# EAGLE schematic Esquematico (EAGLE 9.6.2)
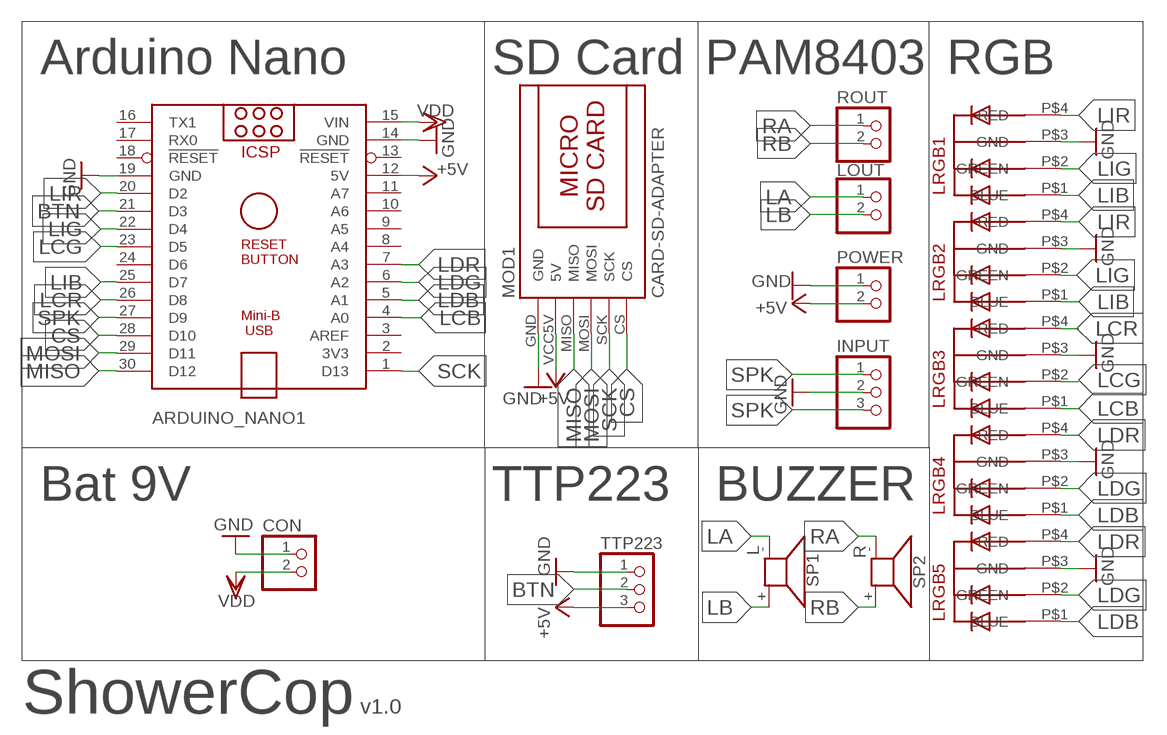
[diagram p0: schematic, sheet 1]

## Parts
ARDUINO_NANO1  ARDUINO_NANO  [ARDUINO_NANO]
CON  PINHD-1X2  [1X02]
INPUT  PINHD-1X3  [1X03]
LOUT  PINHD-1X2  [1X02]
LRGB1  5MMRGBLED  [LED5MMRGB]
LRGB2  5MMRGBLED  [LED5MMRGB]
LRGB3  5MMRGBLED  [LED5MMRGB]
LRGB4  5MMRGBLED  [LED5MMRGB]
LRGB5  5MMRGBLED  [LED5MMRGB]
MOD1  CARD-SD-ADAPTER  CARD-SD-ADAPTER-CATALEX  [CARD-SD-ADAPTER-CATALEX]
POWER  PINHD-1X2  [1X02]
ROUT  PINHD-1X2  [1X02]
SP1  L  AL11P  [AL11P]
SP2  R  AL11P  [AL11P]
TTP223  PINHD-1X3  [1X03]

## Nets
+5V: ARDUINO_NANO1.12(5V) MOD1.VCC5V(5V) POWER.2 TTP223.3
BTN: ARDUINO_NANO1.21(D3) TTP223.2
CS: ARDUINO_NANO1.28(D10) MOD1.CS
GND: ARDUINO_NANO1.14(GND) ARDUINO_NANO1.19(GND) CON.1 INPUT.2 LRGB1.P$3(GND) LRGB2.P$3(GND) LRGB3.P$3(GND) LRGB4.P$3(GND) LRGB5.P$3(GND) MOD1.GND POWER.1 TTP223.1
LA: LOUT.1 SP1.-
LB: LOUT.2 SP1.+
LCB: ARDUINO_NANO1.4(A0) LRGB3.P$1(BLUE)
LCG: ARDUINO_NANO1.23(D5) LRGB3.P$2(GREEN)
LCR: ARDUINO_NANO1.26(D8) LRGB3.P$4(RED)
LDB: ARDUINO_NANO1.5(A1) LRGB4.P$1(BLUE) LRGB5.P$1(BLUE)
LDG: ARDUINO_NANO1.6(A2) LRGB4.P$2(GREEN) LRGB5.P$2(GREEN)
LDR: ARDUINO_NANO1.7(A3) LRGB4.P$4(RED) LRGB5.P$4(RED)
LIB: ARDUINO_NANO1.25(D7) LRGB1.P$1(BLUE) LRGB2.P$1(BLUE)
LIG: ARDUINO_NANO1.22(D4) LRGB1.P$2(GREEN) LRGB2.P$2(GREEN)
LIR: ARDUINO_NANO1.20(D2) LRGB1.P$4(RED) LRGB2.P$4(RED)
MISO: ARDUINO_NANO1.30(D12) MOD1.MISO
MOSI: ARDUINO_NANO1.29(D11) MOD1.MOSI
RA: ROUT.1 SP2.-
RB: ROUT.2 SP2.+
SCK: ARDUINO_NANO1.1(D13) MOD1.SCK
SPK: ARDUINO_NANO1.27(D9) INPUT.1 INPUT.3
VDD: ARDUINO_NANO1.15(VIN) CON.2
Unconnected: ARDUINO_NANO1.2(3V3) ARDUINO_NANO1.3(AREF) ARDUINO_NANO1.8(A4) ARDUINO_NANO1.9(A5) ARDUINO_NANO1.10(A6) ARDUINO_NANO1.11(A7) ARDUINO_NANO1.13(!RESET) ARDUINO_NANO1.16(TX1) ARDUINO_NANO1.17(RX0) ARDUINO_NANO1.18(!RESET) ARDUINO_NANO1.24(D6)

## Notes on the sheet
- Arduino Nano | SD Card | PAM8403 | RGB
- Bat 9V | TTP223 | BUZZER
- ShowerCop | v1.0

## Library data of the parts
ARDUINO_NANO1 = ArduinoNanoV30:ARDUINO_NANO: Arduino Nano V3.0 Overview: The Arduino Nano is a small, complete, and breadboard-friendly board based on the ATmega328 (Arduino Nano 3.x) or ATmega168 (Arduino Nano 2.x). It has more or less the same functionality of the Arduino Duemilanove, but in a different package. It lacks only a DC power jack, and works with a Mini-B USB cable instead of a standard one. The Nano was designed and is being produced by Gravitech. Specifications: Microcontroller Atmel ATmega168 or ATmega328 Operating Voltage (logic level) 5 V Input Voltage (recommended) 7-12 V Input Voltage (limits) 6-20 V Digital I/O Pins 14 (of which 6 provide PWM output) Analog Input Pins 8 DC Current per I/O Pin 40 mA Flash Memory 16 KB (ATmega168) or 32 KB (ATmega328) of which 2 KB used by bootloader SRAM 1 KB (ATmega168) or 2 KB (ATmega328) EEPROM 512 bytes (ATmega168) or 1 KB (ATmega328) Clock Speed 16 MHz Dimensions 0.73" x 1.70" Length 45 mm Width 18 mm Weigth 5 g Power: The Arduino Nano can be powered via the Mini-B USB connection, 6-20V unregulated external power supply (pin 30), or 5V regulated external power supply (pin 27). The power source is automatically selected to the highest voltage source. Memory: The ATmega168 has 16 KB of flash memory for storing code (of which 2 KB is used for the bootloader); the ATmega328 has 32 KB, (also with 2 KB used for the bootloader). The ATmega168 has 1 KB of SRAM and 512 bytes of EEPROM (which can be read and written with the EEPROM library); the ATmega328 has 2 KB of SRAM and 1 KB of EEPROM. Input and Output: Each of the 14 digital pins on the Nano can be used as an input or output, using pinMode(), digitalWrite(), and digitalRead() functions. They operate at 5 volts. Each pin can provide or receive a maximum of 40 mA and has an internal pull-up resistor (disconnected by default) of 20-50 kOhms. In addition, some pins have specialized functions. Visit Arduino - ArduinoBoardNano <https://www.arduino.cc/en/Main/ArduinoBoardNano>
CON LOUT POWER ROUT = pinhead:PINHD-1X2: PIN HEADER
INPUT TTP223 = pinhead:PINHD-1X3: PIN HEADER
LRGB1-LRGB5 = led_rgb:5MMRGBLED
MOD1 = SD-Card-Module_CATALEX:CARD-SD-ADAPTER-CATALEX: Micro SD Card Adapter Module with onboard 3.3V regulator
SP1 SP2 = buzzer:AL11P: SPEAKER Source: Buerklin; OC_FARNELL: unknown; OC_NEWARK: unknown